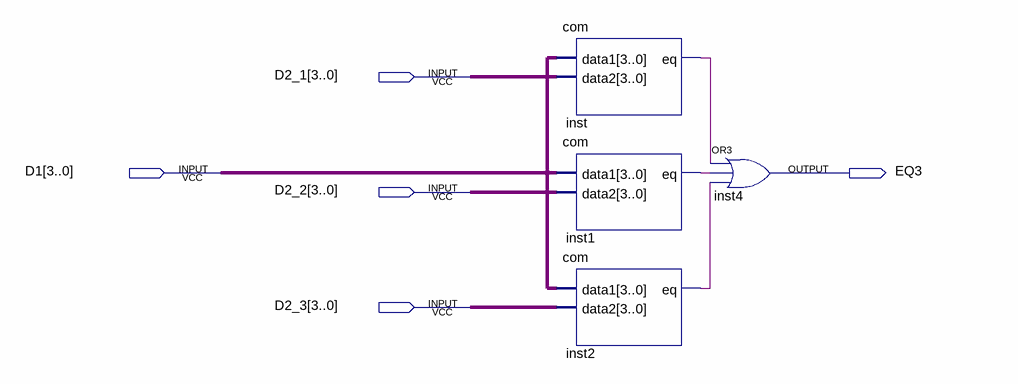
[diagram p0: schematic sheet]
// Quartus schematic c_b_3.bdf as structural Verilog: 4 symbols, 5 pins
module c_b_3 (
  input  [3:0] D2_1,
  input  [3:0] D1,
  input  [3:0] D2_2,
  input  [3:0] D2_3,
  output EQ3
);

  wire inst1_eq, inst2_eq, inst_eq;

  com inst (.data1(D1), .data2(D2_1), .eq(inst_eq));
  com inst1 (.data1(D1), .data2(D2_2), .eq(inst1_eq));
  com inst2 (.data1(D1), .data2(D2_3), .eq(inst2_eq));
  or inst4 (EQ3, inst_eq, inst1_eq, inst2_eq);
endmodule
